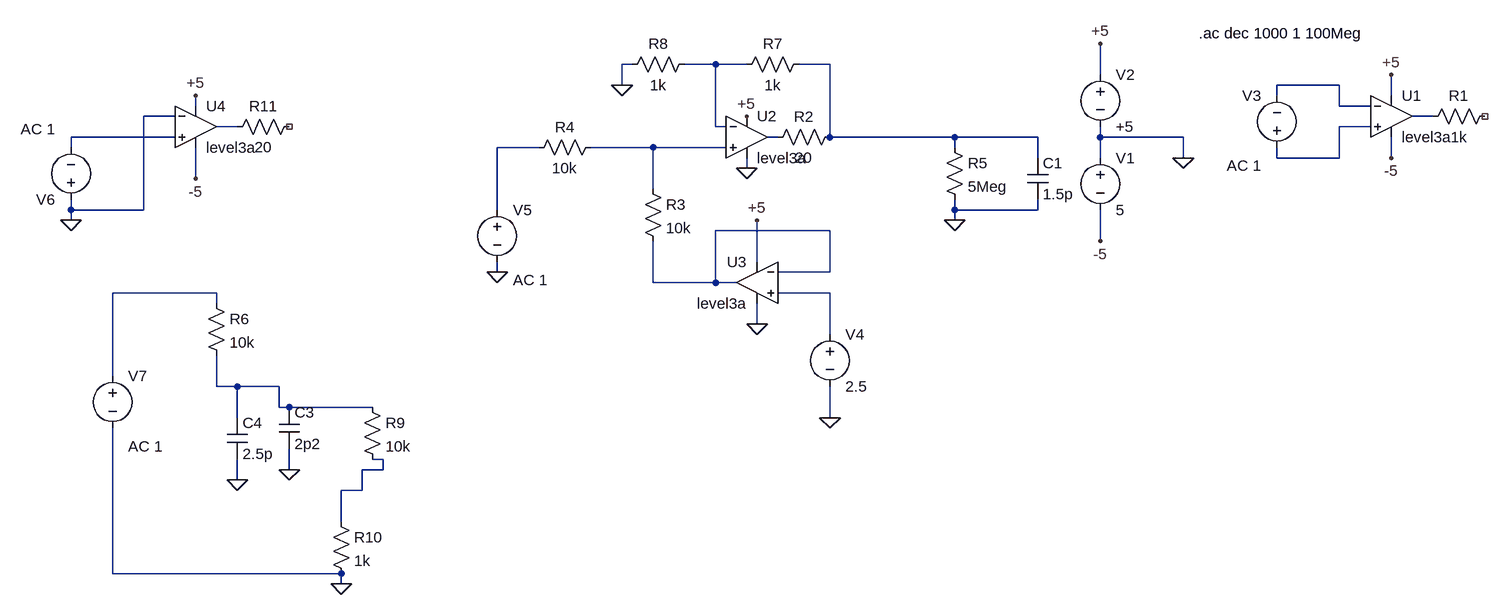
[diagram p0: schematic Simulering af summation med LT1819.asc]
Simulering af summation med LT1819.asc, the LTspice schematic file:
Version 4
SHEET 1 952 900
WIRE -368 80 -384 80
WIRE -240 80 -288 80
WIRE -192 80 -240 80
WIRE -64 80 -112 80
WIRE 352 96 352 48
WIRE -384 112 -384 80
WIRE 720 112 624 112
WIRE 624 128 624 112
WIRE 800 128 800 96
WIRE -1040 144 -1040 128
WIRE 720 144 720 112
WIRE 768 144 720 144
WIRE -1072 160 -1120 160
WIRE 864 160 832 160
WIRE -976 176 -1008 176
WIRE -240 176 -240 80
WIRE -224 176 -240 176
WIRE 768 176 720 176
WIRE -1072 192 -1232 192
WIRE -144 192 -160 192
WIRE -64 192 -64 80
WIRE 128 192 -64 192
WIRE 256 192 128 192
WIRE 352 192 352 176
WIRE 480 192 352 192
WIRE -1232 208 -1232 192
WIRE -512 208 -576 208
WIRE -336 208 -432 208
WIRE -224 208 -336 208
WIRE 128 208 128 192
WIRE 256 224 256 192
WIRE 352 224 352 192
WIRE 480 224 480 192
WIRE 624 224 624 208
WIRE 720 224 720 176
WIRE 720 224 624 224
WIRE 800 224 800 192
WIRE -192 240 -192 224
WIRE -1040 256 -1040 208
WIRE -336 272 -336 208
WIRE -1232 304 -1232 288
WIRE -1120 304 -1120 160
WIRE -1120 304 -1232 304
WIRE -576 304 -576 208
WIRE 128 304 128 288
WIRE 256 304 256 288
WIRE 256 304 128 304
WIRE -1232 320 -1232 304
WIRE 128 320 128 304
WIRE -64 336 -240 336
WIRE 352 352 352 304
WIRE -176 384 -176 320
WIRE -576 400 -576 384
WIRE -64 400 -64 336
WIRE -64 400 -144 400
WIRE -336 416 -336 352
WIRE -240 416 -240 336
WIRE -240 416 -336 416
WIRE -208 416 -240 416
WIRE -1008 432 -1168 432
WIRE -64 432 -144 432
WIRE -1008 448 -1008 432
WIRE -176 480 -176 448
WIRE -64 496 -64 432
WIRE -1168 560 -1168 432
WIRE -1008 576 -1008 528
WIRE -976 576 -1008 576
WIRE -912 576 -976 576
WIRE -912 608 -912 576
WIRE -896 608 -912 608
WIRE -768 608 -896 608
WIRE -976 624 -976 576
WIRE -64 624 -64 576
WIRE -752 688 -768 688
WIRE -896 704 -896 672
WIRE -752 704 -752 688
WIRE -752 704 -784 704
WIRE -976 720 -976 688
WIRE -784 736 -784 704
WIRE -784 736 -816 736
WIRE -816 784 -816 736
WIRE -1168 864 -1168 640
WIRE -816 864 -1168 864
WIRE -816 880 -816 864
FLAG 480 224 0
FLAG 352 352 -5
FLAG 352 48 +5
FLAG 800 96 +5
FLAG 800 224 -5
FLAG -192 160 +5
FLAG -192 240 0
FLAG -176 320 +5
FLAG -176 480 0
FLAG -64 624 0
FLAG -576 400 0
FLAG 128 320 0
FLAG -384 112 0
FLAG -896 704 0
FLAG -816 880 0
FLAG -976 720 0
FLAG -1040 128 +5
FLAG -1040 256 -5
FLAG -1232 320 0
SYMBOL voltage 352 208 R0
WINDOW 123 0 0 Left 0
WINDOW 39 0 0 Left 0
SYMATTR InstName V1
SYMATTR Value 5
SYMBOL voltage 352 80 R0
WINDOW 123 0 0 Left 0
WINDOW 39 0 0 Left 0
SYMATTR InstName V2
SYMATTR Value +5
SYMBOL Opamps\\UniversalOpAmp3 800 160 R0
SYMATTR InstName U1
SYMATTR Value2 Avol=1.259Meg GBW=38Meg Slew=22Meg
SYMATTR SpiceLine Ilimit=25m Rail=0 Vos=0 Phimargin=56
SYMATTR SpiceLine2 En=0 Enk=0 In=0 Ink=0 Rin=1Meg
SYMBOL res 960 144 R90
WINDOW 0 0 56 VBottom 2
WINDOW 3 32 56 VTop 2
SYMATTR InstName R1
SYMATTR Value 1k
SYMBOL voltage 624 224 R180
WINDOW 0 24 96 Left 2
WINDOW 3 24 16 Left 2
WINDOW 123 24 -12 Left 2
WINDOW 39 0 0 Left 0
SYMATTR InstName V3
SYMATTR Value ""
SYMATTR Value2 AC 1
SYMBOL Opamps\\UniversalOpAmp3 -192 192 R0
SYMATTR InstName U2
SYMATTR Value2 Avol=2371 GBW=360Meg Slew=2250Meg
SYMATTR SpiceLine Ilimit=70m Rail=0 Vos=0 Phimargin=35
SYMATTR SpiceLine2 En=0 Enk=0 In=0 Ink=0 Rin=1Meg
SYMBOL res -352 256 R0
SYMATTR InstName R3
SYMATTR Value 10k
SYMBOL res -416 192 R90
WINDOW 0 0 56 VBottom 2
WINDOW 3 32 56 VTop 2
SYMATTR InstName R4
SYMATTR Value 10k
SYMBOL Opamps\\UniversalOpAmp3 -176 416 M0
SYMATTR InstName U3
SYMATTR Value2 Avol=1.259Meg GBW=38Meg Slew=22Meg
SYMATTR SpiceLine Ilimit=25m Rail=0 Vos=0 Phimargin=56
SYMATTR SpiceLine2 En=0 Enk=0 In=0 Ink=0 Rin=1Meg
SYMBOL voltage -64 480 R0
WINDOW 123 0 0 Left 0
WINDOW 39 0 0 Left 0
SYMATTR InstName V4
SYMATTR Value 2.5
SYMBOL voltage -576 288 R0
WINDOW 123 24 124 Left 2
WINDOW 39 0 0 Left 0
SYMATTR Value2 AC 1
SYMATTR InstName V5
SYMATTR Value ""
SYMBOL res 112 192 R0
SYMATTR InstName R5
SYMATTR Value 5Meg
SYMBOL cap 240 224 R0
SYMATTR InstName C1
SYMATTR Value 1.5p
SYMBOL res -96 64 R90
WINDOW 0 0 56 VBottom 2
WINDOW 3 32 56 VTop 2
SYMATTR InstName R7
SYMATTR Value 1k
SYMBOL res -272 64 R90
WINDOW 0 0 56 VBottom 2
WINDOW 3 32 56 VTop 2
SYMATTR InstName R8
SYMATTR Value 1k
SYMBOL res -1024 432 R0
SYMATTR InstName R6
SYMATTR Value 10k
SYMBOL res -784 592 R0
SYMATTR InstName R9
SYMATTR Value 10k
SYMBOL cap -912 608 R0
SYMATTR InstName C3
SYMATTR Value 2p2
SYMBOL voltage -1168 544 R0
WINDOW 123 24 124 Left 2
WINDOW 39 0 0 Left 0
SYMATTR Value2 AC 1
SYMATTR InstName V7
SYMATTR Value ""
SYMBOL res -832 768 R0
SYMATTR InstName R10
SYMATTR Value 1k
SYMBOL cap -992 624 R0
SYMATTR InstName C4
SYMATTR Value 2.5p
SYMBOL Opamps\\UniversalOpAmp3 -1040 176 R0
SYMATTR InstName U4
SYMATTR Value2 Avol=2371 GBW=360Meg Slew=2250Meg
SYMATTR SpiceLine Ilimit=70m Rail=0 Vos=0 Phimargin=35
SYMATTR SpiceLine2 En=0 Enk=0 In=0 Ink=0 Rin=1Meg
SYMBOL voltage -1232 304 R180
WINDOW 123 24 124 Left 2
WINDOW 39 0 0 Left 0
SYMATTR Value2 AC 1
SYMATTR InstName V6
SYMATTR Value ""
SYMBOL res -880 160 R90
WINDOW 0 0 56 VBottom 2
WINDOW 3 32 56 VTop 2
SYMATTR InstName R11
SYMATTR Value 20
SYMBOL res -48 176 R90
WINDOW 0 0 56 VBottom 2
WINDOW 3 32 56 VTop 2
SYMATTR InstName R2
SYMATTR Value 20
TEXT 504 32 Left 2 !.ac dec 1000 1 100Meg

The netlist it stands for:
* Simulering af summation med LT1819.asc
V1 0 -5 5
V2 +5 0 +5
XU1 N006 N003 +5 -5 N004 level3a Avol=1.259Meg GBW=38Meg Slew=22Meg Ilimit=25m Rail=0 Vos=0 Phimargin=56 En=0 Enk=0 In=0 Ink=0 Rin=1Meg  ; pins In+ In- V+ V- OUT
R1 NC_01 N004 1k
V3 N006 N003 AC 1
XU2 N010 N001 +5 0 N008 level3a Avol=2371 GBW=360Meg Slew=2250Meg Ilimit=70m Rail=0 Vos=0 Phimargin=35 En=0 Enk=0 In=0 Ink=0 Rin=1Meg  ; pins In+ In- V+ V- OUT
R3 N010 N011 10k
R4 N010 N009 10k
XU3 N013 N011 +5 0 N011 level3a Avol=1.259Meg GBW=38Meg Slew=22Meg Ilimit=25m Rail=0 Vos=0 Phimargin=56 En=0 Enk=0 In=0 Ink=0 Rin=1Meg  ; pins In+ In- V+ V- OUT
V4 N013 0 2.5
V5 N009 0 AC 1
R5 N002 0 5Meg
C1 N002 0 1.5p
R7 N002 N001 1k
R8 N001 0 1k
R6 N012 N014 10k
R9 N014 N015 10k
C3 N014 0 2p2
V7 N012 0 AC 1
R10 N015 0 1k
C4 N014 0 2.5p
XU4 N007 0 +5 -5 N005 level3a Avol=2371 GBW=360Meg Slew=2250Meg Ilimit=70m Rail=0 Vos=0 Phimargin=35 En=0 Enk=0 In=0 Ink=0 Rin=1Meg  ; pins In+ In- V+ V- OUT
V6 0 N007 AC 1
R11 NC_02 N005 20
R2 N002 N008 20
.ac dec 1000 1 100Meg
.backanno
.end